# EAGLE design light-ring (EAGLE 7.6.0)
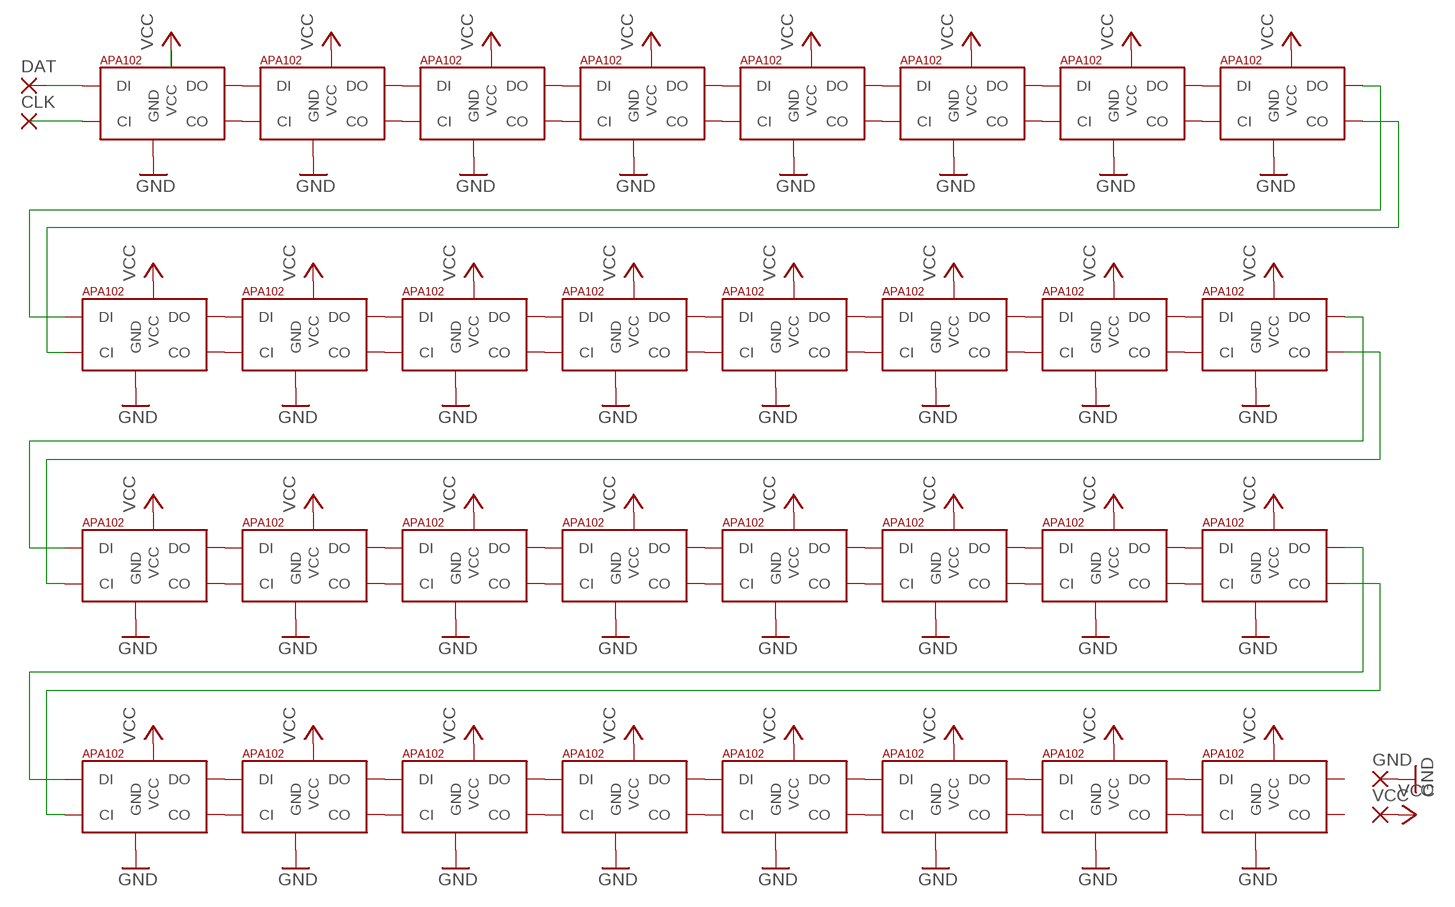
[diagram p0: schematic, sheet 1]

## Parts
CLK  2,15/1,0  [2,15/1,0]
DAT  2,15/1,0  [2,15/1,0]
GND  2,15/1,0  [2,15/1,0]
LED_1  APA1025050  [APA102_5050]
LED_2  APA1025050  [APA102_5050]
LED_3  APA1025050  [APA102_5050]
LED_4  APA1025050  [APA102_5050]
LED_5  APA1025050  [APA102_5050]
LED_6  APA1025050  [APA102_5050]
LED_7  APA1025050  [APA102_5050]
LED_8  APA1025050  [APA102_5050]
LED_9  APA1025050  [APA102_5050]
LED_10  APA1025050  [APA102_5050]
LED_11  APA1025050  [APA102_5050]
LED_12  APA1025050  [APA102_5050]
LED_13  APA1025050  [APA102_5050]
LED_14  APA1025050  [APA102_5050]
LED_15  APA1025050  [APA102_5050]
LED_16  APA1025050  [APA102_5050]
LED_17  APA1025050  [APA102_5050]
LED_18  APA1025050  [APA102_5050]
LED_19  APA1025050  [APA102_5050]
LED_20  APA1025050  [APA102_5050]
LED_21  APA1025050  [APA102_5050]
LED_22  APA1025050  [APA102_5050]
LED_23  APA1025050  [APA102_5050]
LED_24  APA1025050  [APA102_5050]
LED_25  APA1025050  [APA102_5050]
LED_26  APA1025050  [APA102_5050]
LED_27  APA1025050  [APA102_5050]
LED_28  APA1025050  [APA102_5050]
LED_29  APA1025050  [APA102_5050]
LED_30  APA1025050  [APA102_5050]
LED_31  APA1025050  [APA102_5050]
LED_32  APA1025050  [APA102_5050]
VCC  2,15/1,0  [2,15/1,0]

## Nets
CLK_IN: CLK.1(P) LED_1.5(CI)
DAT_IN: DAT.1(P) LED_1.4(DI)
GND: GND.1(P) LED_1.6(GND) LED_2.6(GND) LED_3.6(GND) LED_4.6(GND) LED_5.6(GND) LED_6.6(GND) LED_7.6(GND) LED_8.6(GND) LED_9.6(GND) LED_10.6(GND) LED_11.6(GND) LED_12.6(GND) LED_13.6(GND) LED_14.6(GND) LED_15.6(GND) LED_16.6(GND) LED_17.6(GND) LED_18.6(GND) LED_19.6(GND) LED_20.6(GND) LED_21.6(GND) LED_22.6(GND) LED_23.6(GND) LED_24.6(GND) LED_25.6(GND) LED_26.6(GND) LED_27.6(GND) LED_28.6(GND) LED_29.6(GND) LED_30.6(GND) LED_31.6(GND) LED_32.6(GND)
N$1: LED_1.3(DO) LED_2.4(DI)
N$2: LED_1.2(CO) LED_2.5(CI)
N$3: LED_2.3(DO) LED_3.4(DI)
N$4: LED_2.2(CO) LED_3.5(CI)
N$5: LED_3.3(DO) LED_4.4(DI)
N$6: LED_3.2(CO) LED_4.5(CI)
N$7: LED_4.3(DO) LED_5.4(DI)
N$8: LED_4.2(CO) LED_5.5(CI)
N$9: LED_5.3(DO) LED_6.4(DI)
N$10: LED_5.2(CO) LED_6.5(CI)
N$11: LED_6.3(DO) LED_7.4(DI)
N$12: LED_6.2(CO) LED_7.5(CI)
N$13: LED_7.3(DO) LED_8.4(DI)
N$14: LED_7.2(CO) LED_8.5(CI)
N$15: LED_8.3(DO) LED_9.4(DI)
N$16: LED_8.2(CO) LED_9.5(CI)
N$17: LED_9.2(CO) LED_10.5(CI)
N$18: LED_9.3(DO) LED_10.4(DI)
N$19: LED_10.2(CO) LED_11.5(CI)
N$20: LED_10.3(DO) LED_11.4(DI)
N$21: LED_11.2(CO) LED_12.5(CI)
N$22: LED_11.3(DO) LED_12.4(DI)
N$23: LED_12.2(CO) LED_13.5(CI)
N$24: LED_12.3(DO) LED_13.4(DI)
N$25: LED_13.2(CO) LED_14.5(CI)
N$26: LED_13.3(DO) LED_14.4(DI)
N$27: LED_14.2(CO) LED_15.5(CI)
N$28: LED_14.3(DO) LED_15.4(DI)
N$29: LED_15.2(CO) LED_16.5(CI)
N$30: LED_15.3(DO) LED_16.4(DI)
N$31: LED_17.2(CO) LED_18.5(CI)
N$32: LED_17.3(DO) LED_18.4(DI)
N$33: LED_18.2(CO) LED_19.5(CI)
N$34: LED_18.3(DO) LED_19.4(DI)
N$35: LED_19.2(CO) LED_20.5(CI)
N$36: LED_19.3(DO) LED_20.4(DI)
N$37: LED_20.2(CO) LED_21.5(CI)
N$38: LED_20.3(DO) LED_21.4(DI)
N$39: LED_21.2(CO) LED_22.5(CI)
N$40: LED_21.3(DO) LED_22.4(DI)
N$41: LED_22.2(CO) LED_23.5(CI)
N$42: LED_22.3(DO) LED_23.4(DI)
N$43: LED_23.2(CO) LED_24.5(CI)
N$44: LED_23.3(DO) LED_24.4(DI)
N$45: LED_25.2(CO) LED_26.5(CI)
N$46: LED_25.3(DO) LED_26.4(DI)
N$47: LED_26.2(CO) LED_27.5(CI)
N$48: LED_26.3(DO) LED_27.4(DI)
N$49: LED_27.2(CO) LED_28.5(CI)
N$50: LED_27.3(DO) LED_28.4(DI)
N$51: LED_28.2(CO) LED_29.5(CI)
N$52: LED_28.3(DO) LED_29.4(DI)
N$53: LED_29.2(CO) LED_30.5(CI)
N$54: LED_29.3(DO) LED_30.4(DI)
N$55: LED_30.2(CO) LED_31.5(CI)
N$56: LED_30.3(DO) LED_31.4(DI)
N$57: LED_31.2(CO) LED_32.5(CI)
N$58: LED_31.3(DO) LED_32.4(DI)
N$59: LED_16.3(DO) LED_17.4(DI)
N$60: LED_16.2(CO) LED_17.5(CI)
N$61: LED_24.3(DO) LED_25.4(DI)
N$62: LED_24.2(CO) LED_25.5(CI)
VCC: LED_1.1(VCC) LED_2.1(VCC) LED_3.1(VCC) LED_4.1(VCC) LED_5.1(VCC) LED_6.1(VCC) LED_7.1(VCC) LED_8.1(VCC) LED_9.1(VCC) LED_10.1(VCC) LED_11.1(VCC) LED_12.1(VCC) LED_13.1(VCC) LED_14.1(VCC) LED_15.1(VCC) LED_16.1(VCC) LED_17.1(VCC) LED_18.1(VCC) LED_19.1(VCC) LED_20.1(VCC) LED_21.1(VCC) LED_22.1(VCC) LED_23.1(VCC) LED_24.1(VCC) LED_25.1(VCC) LED_26.1(VCC) LED_27.1(VCC) LED_28.1(VCC) LED_29.1(VCC) LED_30.1(VCC) LED_31.1(VCC) LED_32.1(VCC) VCC.1(P)
Unconnected: LED_32.2(CO) LED_32.3(DO)

## Library data of the parts
CLK DAT GND VCC = wirepad:2,15/1,0: THROUGH-HOLE PAD
LED_1-LED_32 = jos-ph:APA102: APA102C 5050 RGB LED -- Adafruit DotStar Single LED Pixel Product Page: https://www.adafruit.com/products/2343 Datasheet: https://cdn-shop.adafruit.com/product-files/2343/APA102C.pdf

## Board
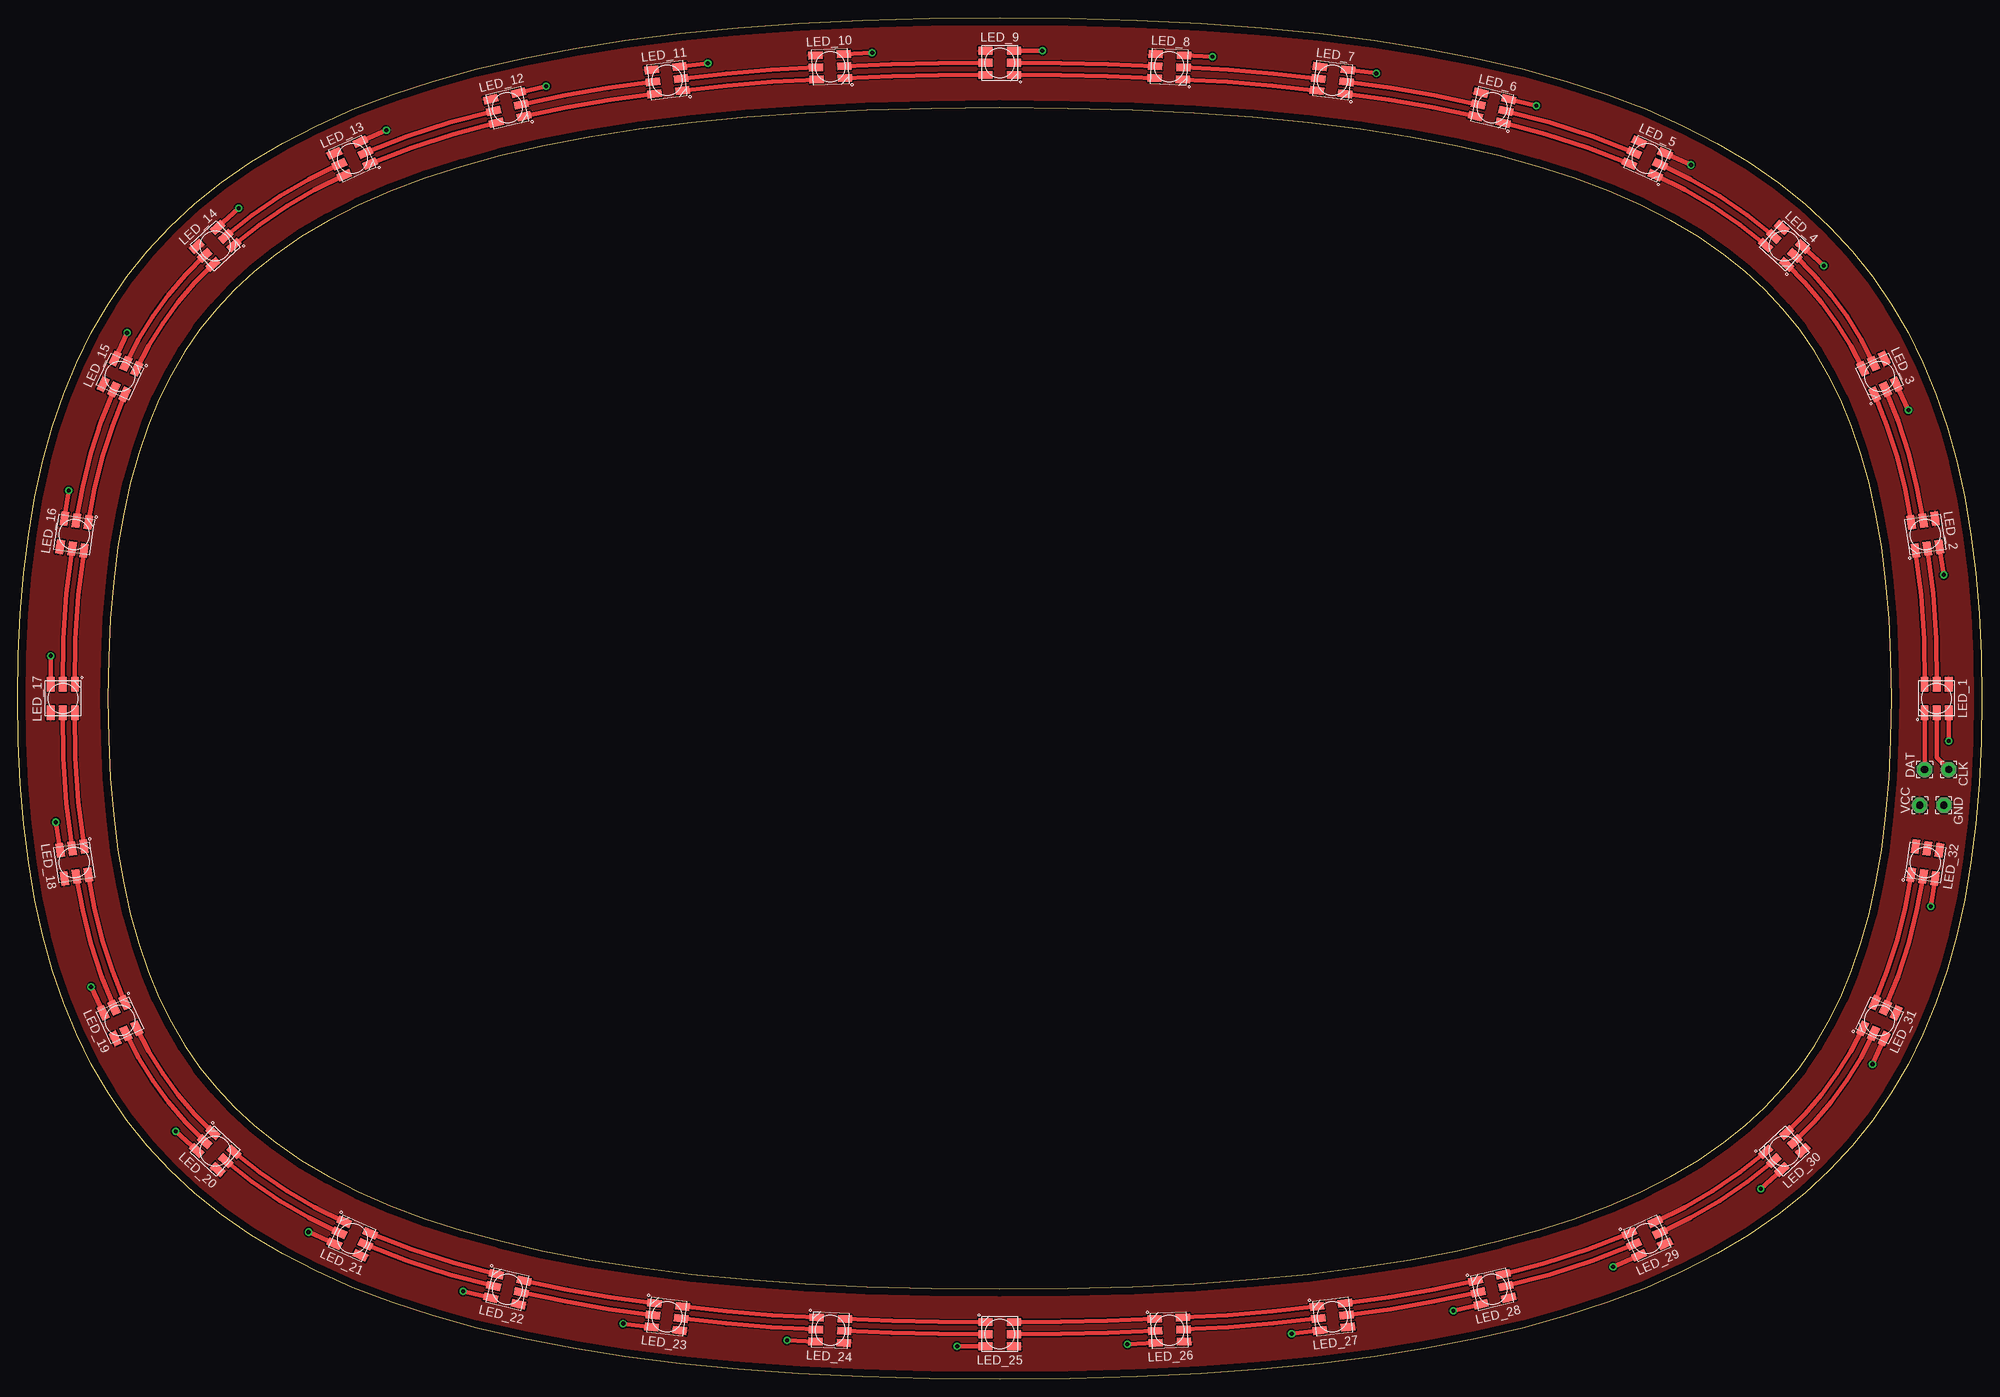
[diagram p1: board, top side]
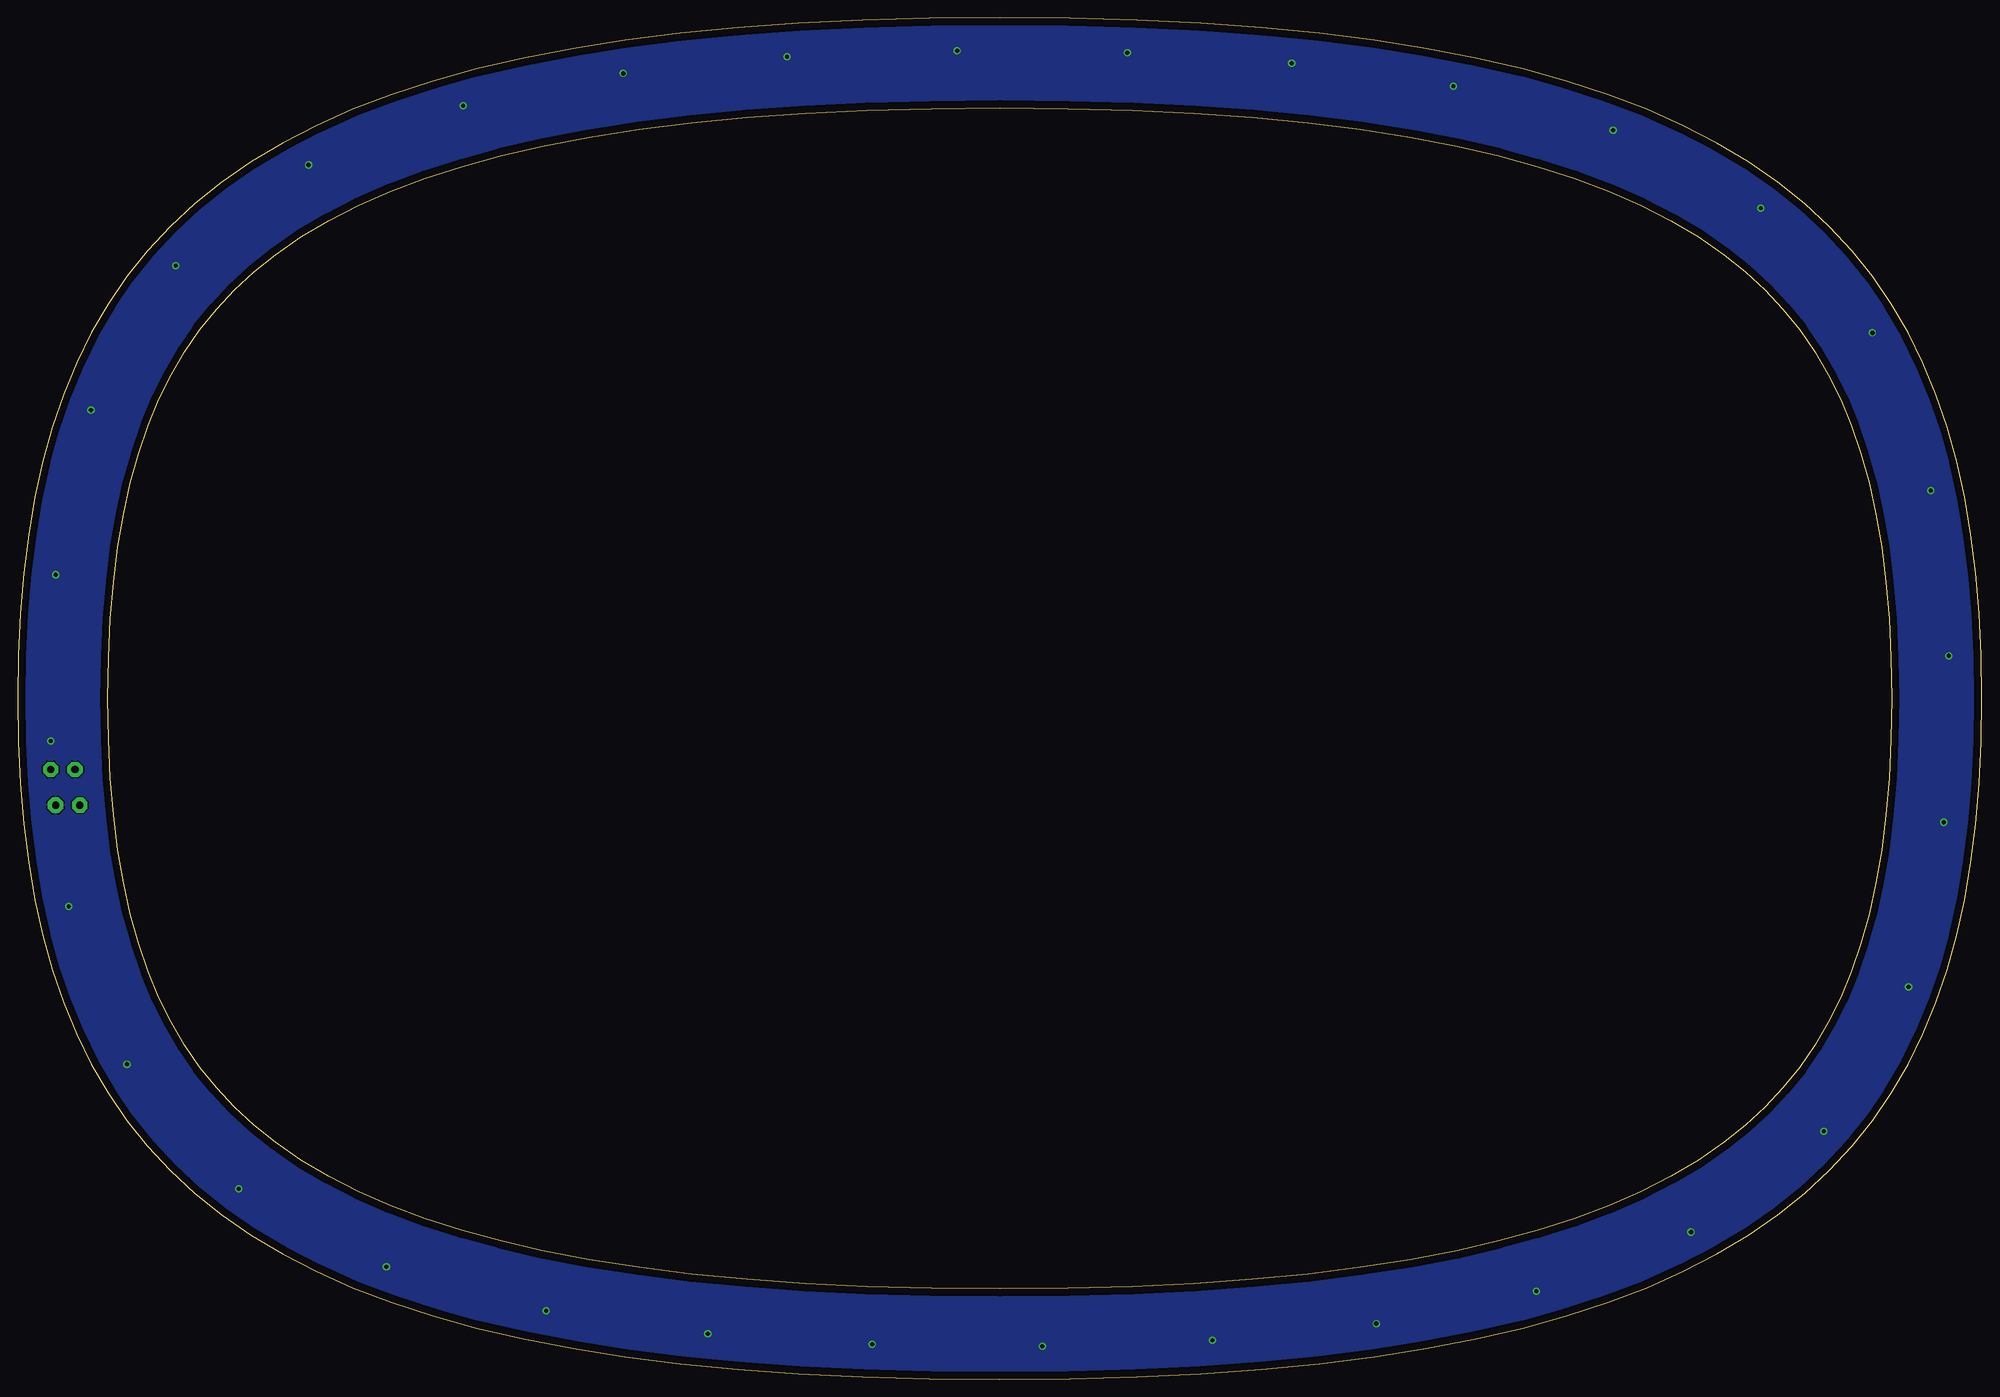
[diagram p2: board, bottom side, seen from below]

Size 276.51 x 191.7 mm. Coordinates in mm from the lower left corner, seen from the top.
Outline: 0,95.85 0.09,101.94 0.37,107.82 0.84,113.49 1.52,118.95 2.42,124.2 3.53,129.25 4.87,134.08 6.46,138.72 8.29,143.15 10.37,147.38 12.72,151.4 15.35,155.23 18.25,158.86 21.45,162.29 24.94,165.53 28.74,168.57 32.85,171.41 37.29,174.07 42.07,176.53 47.18,178.8 52.64,180.89 58.46,182.78 64.65,184.5 71.21,186.02 78.16,187.36 85.5,188.52 93.24,189.5 101.39,190.29 109.96,190.91 118.95,191.35 128.38,191.61 138.25,191.7 148.13,191.61 157.56,191.35 166.55,190.91 175.12,190.29 183.27,189.5 191.01,188.52 198.35,187.36 205.29,186.02 211.86,184.5 218.04,182.78 223.87,180.89 229.33,178.8 234.44,176.53 239.21,174.07 243.65,171.41 247.77,168.57 251.57,165.53 255.06,162.29 258.26,158.86 261.16,155.23 263.78,151.4 266.13,147.38 268.22,143.15 270.05,138.72 271.63,134.08 272.98,129.25 274.09,124.2 274.98,118.95 275.66,113.49 276.14,107.82 276.42,101.94 276.51,95.85 276.42,89.76 276.14,83.88 275.66,78.21 274.98,72.75 274.09,67.5 272.98,62.45 271.63,57.62 270.05,52.98 268.22,48.55 266.13,44.32 263.78,40.3 261.16,36.47 258.26,32.84 255.06,29.41 251.57,26.17 247.77,23.13 243.65,20.29 239.21,17.63 234.44,15.17 229.33,12.9 223.87,10.81 218.04,8.91 211.86,7.21 205.29,5.68 198.35,4.34 191.01,3.18 183.27,2.2 175.12,1.41 166.55,0.79 157.56,0.35 148.13,0.09 138.25,0 128.38,0.09 118.95,0.35 109.96,0.79 101.39,1.41 93.24,2.2 85.5,3.18 78.16,4.34 71.21,5.68 64.65,7.21 58.46,8.91 52.64,10.81 47.18,12.9 42.07,15.17 37.29,17.63 32.85,20.29 28.74,23.13 24.94,26.17 21.45,29.41 18.25,32.84 15.35,36.47 12.72,40.3 10.37,44.32 8.29,48.55 6.46,52.98 4.87,57.62 3.53,62.45 2.42,67.5 1.52,72.75 0.84,78.21 0.37,83.88 0.09,89.76 0,95.85
Outline: 202.66,18.1 208.51,19.46 214.01,20.96 219.18,22.62 224.01,24.43 228.52,26.4 232.71,28.54 236.6,30.85 240.19,33.32 243.19,35.72 245.97,38.29 248.53,41.02 250.88,43.94 253.01,47.03 254.93,50.31 256.65,53.78 258.17,57.45 259.5,61.36 260.65,65.5 261.62,69.89 262.41,74.53 263.02,79.44 263.46,84.63 263.72,90.09 263.81,95.85 263.72,101.61 263.46,107.07 263.02,112.26 262.41,117.17 261.62,121.81 260.65,126.2 259.5,130.34 258.17,134.24 256.65,137.91 254.93,141.39 253.01,144.67 250.88,147.76 248.53,150.67 245.97,153.41 243.19,155.98 240.19,158.38 236.6,160.85 232.71,163.16 228.52,165.29 224.01,167.27 219.18,169.08 214.01,170.74 208.51,172.24 202.66,173.6 196.04,174.87 189.05,175.97 181.66,176.9 173.85,177.66 165.63,178.25 156.96,178.67 147.84,178.92 138.25,179 128.67,178.92 119.55,178.67 110.88,178.25 102.65,177.66 94.85,176.9 87.46,175.97 80.46,174.87 73.85,173.6 68,172.24 62.5,170.74 57.33,169.08 52.5,167.27 47.99,165.29 43.8,163.16 39.91,160.85 36.32,158.38 33.31,155.98 30.54,153.41 27.98,150.67 25.63,147.76 23.5,144.67 21.58,141.39 19.86,137.91 18.34,134.24 17.01,130.34 15.86,126.2 14.89,121.81 14.1,117.17 13.48,112.26 13.05,107.07 12.79,101.61 12.7,95.85 12.79,90.09 13.05,84.63 13.48,79.44 14.1,74.53 14.89,69.89 15.86,65.5 17.01,61.36 18.34,57.45 19.86,53.78 21.58,50.31 23.5,47.03 25.63,43.94 27.98,41.02 30.54,38.29 33.31,35.72 36.32,33.32 39.91,30.85 43.8,28.54 47.99,26.4 52.5,24.43 57.33,22.62 62.5,20.96 68,19.46 73.85,18.1 80.46,16.83 87.46,15.72 94.85,14.8 102.65,14.04 110.88,13.45 119.55,13.03 128.67,12.78 138.25,12.7 147.84,12.78 156.96,13.03 165.63,13.45 173.85,14.04 181.66,14.8 189.05,15.72 196.04,16.83 202.66,18.1
Copper layers (1*16): Top 0.035mm / dielectric 1.5mm / Bottom 0.035mm
Design rules "default": minimum track width 10mil, minimum drill 24mil, track to track 8mil, track to pad 8mil, pad to pad 8mil, via to via 8mil, smd to smd 8mil, copper to edge 40mil, drill to drill 8mil, minimum pad ring 10mil, minimum via ring 8mil, stop-mask expansion 4mil, vias tented up to drill 0mil, thermal gap 10mil
Milling: 128 lines

### Footprints (pad centres in the part's own frame; a part is rotated, then mirrored left to right if it is on the bottom)
2,15/1,0 = drill 1.016 pad 2.159 octagon: 1 0,0
APA102_5050 = smd 2 x 1.1: 1 2,-1.7; 2 2,0; 3 2,1.7; 4 -2,1.7; 5 -2,0; 6 -2,-1.7

### Placement (x,y rotation side)
CLK  271.86,85.85 270 top
DAT  268.46,85.85 90 top
GND  271.17,80.83 270 top
LED_1  270.16,95.85 90 top
LED_2  268.56,118.93 98.8 top
LED_3  262.12,141.19 115 top
LED_4  248.7,159.59 137.6 top
LED_5  229.4,171.88 155.9 top
LED_6  207.57,179.03 166.8 top
LED_7  185.1,182.9 173.1 top
LED_8  162.13,184.8 177.2 top
LED_9  138.25,185.35 180 top
LED_10  114.38,184.8 182.8 top
LED_11  91.41,182.9 186.9 top
LED_12  68.94,179.03 193.2 top
LED_13  47.11,171.88 204.1 top
LED_14  27.81,159.59 222.4 top
LED_15  14.39,141.19 245 top
LED_16  7.95,118.93 261.2 top
LED_17  6.35,95.85 270 top
LED_18  7.95,72.77 278.8 top
LED_19  14.39,50.51 295 top
LED_20  27.81,32.11 317.6 top
LED_21  47.11,19.82 335.9 top
LED_22  68.94,12.67 346.8 top
LED_23  91.41,8.79 353.1 top
LED_24  114.38,6.9 357.2 top
LED_25  138.25,6.35 0 top
LED_26  162.13,6.9 2.8 top
LED_27  185.1,8.79 6.9 top
LED_28  207.57,12.67 13.2 top
LED_29  229.4,19.82 24.1 top
LED_30  248.7,32.11 42.4 top
LED_31  262.12,50.51 65 top
LED_32  268.56,72.77 81.2 top
VCC  267.77,80.83 90 top

### Tracks (layer width: path | path; a pad name or v marks a point on that pad's centre or on a via)
CLK_IN
  Top 0.61: LED_1.5 270.16,87.55 CLK.1
DAT_IN
  Top 0.61: LED_1.4 DAT.1
GND  (via drill 0.6)
  Top 0.61: v120.29,186.79 LED_10.6 | LED_11.6 v97.16,185.31 | LED_9.6 v144.25,187.05 | LED_8.6 v168.2,186.2 | v191.26,183.87 LED_7.6 | LED_6.6 v213.8,179.31 | LED_5.6 v235.57,170.98 | LED_4.6 v254.27,156.8 | LED_12.6 v74.39,182.05 | LED_13.6 v51.89,175.88 | LED_14.6 v31.1,164.89 | v15.39,147.35 LED_15.6 | v7.19,125.12 LED_16.6 | v4.65,101.85 LED_17.6 | v5.35,78.44 LED_18.6 | v10.31,55.23 LED_19.6 | v22.23,34.9 LED_20.6 | v266.19,136.47 LED_3.6 | v40.94,20.72 LED_21.6 | v62.71,12.39 LED_22.6 | v85.25,7.83 LED_23.6 | v108.31,5.5 LED_24.6 | v132.25,4.65 LED_25.6 | v156.22,4.91 LED_26.6 | v179.35,6.39 LED_27.6 | v202.11,9.65 LED_28.6 | v224.62,15.82 LED_29.6 | v245.41,26.81 LED_30.6 | LED_2.6 v271.15,113.26 | LED_31.6 v261.12,44.35 | LED_32.6 v269.32,66.58 | LED_1.6 v271.86,89.85
  Top 0.813: LED_1.6
  pour Bottom: 0,95.85 0.09,101.94 0.37,107.82 0.84,113.49 1.52,118.95 2.42,124.2 3.53,129.24 4.87,134.08 6.46,138.72 8.29,143.15 10.37,147.38 12.72,151.4 15.35,155.23 18.25,158.86 21.45,162.29 24.94,165.53 28.74,168.57 32.85,171.41 37.29,174.07 42.07,176.53 47.18,178.8 52.64,180.89 58.46,182.78 64.65,184.49 71.21,186.02 78.16,187.36 85.5,188.52 93.24,189.5 101.39,190.29 109.96,190.91 118.95,191.35 128.38,191.61 138.25,191.7 148.13,191.61 157.56,191.35 166.55,190.91 175.12,190.29 183.27,189.5 191.01,188.52 198.35,187.36 205.29,186.02 211.86,184.49 218.04,182.78 223.87,180.89 229.33,178.8 234.44,176.53 239.21,174.07 243.65,171.41 247.77,168.57 251.57,165.53 255.06,162.29 258.26,158.86 261.16,155.23 263.78,151.4 266.13,147.38 268.22,143.15 270.05,138.72 271.63,134.08 272.98,129.24 274.09,124.2 274.98,118.95 275.66,113.49 276.14,107.82 276.42,101.94 276.51,95.85 276.42,89.76 276.14,83.88 275.66,78.21 274.98,72.75 274.09,67.5 272.98,62.45 271.63,57.62 270.05,52.98 268.22,48.55 266.13,44.32 263.78,40.3 261.16,36.47 258.26,32.84 255.06,29.41 251.57,26.17 247.77,23.13 243.65,20.29 239.21,17.63 234.44,15.17 229.33,12.9 223.87,10.81 218.04,8.92 211.86,7.2 205.29,5.68 198.35,4.34 191.01,3.18 183.27,2.2 175.12,1.41 166.55,0.79 157.56,0.35 148.13,0.09 138.25,0 128.38,0.09 118.95,0.35 109.96,0.79 101.39,1.41 93.24,2.2 85.5,3.18 78.16,4.34 71.21,5.68 64.65,7.2 58.46,8.92 52.64,10.81 47.18,12.9 42.07,15.17 37.29,17.63 32.85,20.29 28.74,23.13 24.94,26.17 21.45,29.41 18.25,32.84 15.35,36.47 12.72,40.3 10.37,44.32 8.29,48.55 6.46,52.98 4.87,57.62 3.53,62.45 2.42,67.5 1.52,72.75 0.84,78.21 0.37,83.88 0.09,89.76 0,95.85 12.7,95.85 12.79,90.09 13.05,84.63 13.48,79.44 14.1,74.53 14.89,69.89 15.86,65.5 17.01,61.36 18.34,57.46 19.86,53.79 21.58,50.31 23.5,47.03 25.63,43.94 27.98,41.03 30.53,38.29 33.31,35.72 36.32,33.32 39.91,30.85 43.8,28.54 47.99,26.4 52.5,24.43 57.33,22.62 62.5,20.96 68,19.46 73.85,18.1 80.46,16.83 87.46,15.73 94.85,14.8 102.65,14.04 110.88,13.45 119.55,13.03 128.67,12.78 138.25,12.7 147.84,12.78 156.96,13.03 165.63,13.45 173.85,14.04 181.66,14.8 189.05,15.73 196.04,16.83 202.66,18.1 208.51,19.46 214.01,20.96 219.17,22.62 224.01,24.43 228.52,26.4 232.71,28.54 236.6,30.85 240.19,33.32 243.19,35.72 245.97,38.29 248.53,41.03 250.88,43.94 253.01,47.03 254.93,50.31 256.65,53.79 258.16,57.46 259.5,61.36 260.65,65.5 261.62,69.89 262.41,74.53 263.02,79.44 263.46,84.63 263.72,90.09 263.81,95.85 263.72,101.61 263.46,107.07 263.02,112.26 262.41,117.17 261.62,121.81 260.65,126.2 259.5,130.34 258.16,134.24 256.65,137.91 254.93,141.39 253.01,144.67 250.88,147.76 248.53,150.67 245.97,153.41 243.19,155.98 240.19,158.38 236.6,160.85 232.71,163.16 228.52,165.3 224.01,167.27 219.17,169.08 214.01,170.74 208.51,172.24 202.66,173.6 196.04,174.87 189.05,175.97 181.66,176.9 173.85,177.66 165.63,178.25 156.96,178.67 147.84,178.92 138.25,179 128.67,178.92 119.55,178.67 110.88,178.25 102.65,177.66 94.85,176.9 87.46,175.97 80.46,174.87 73.85,173.6 68,172.24 62.5,170.74 57.33,169.08 52.5,167.27 47.99,165.3 43.8,163.16 39.91,160.85 36.32,158.38 33.31,155.98 30.53,153.41 27.98,150.67 25.63,147.76 23.5,144.67 21.58,141.39 19.86,137.91 18.34,134.24 17.01,130.34 15.86,126.2 14.89,121.81 14.1,117.17 13.48,112.26 13.05,107.07 12.79,101.61 12.7,95.85
N$1
  Top 0.61: LED_1.3 arc10 LED_2.4
N$2
  Top 0.61: LED_2.5 arc-10 LED_1.2
N$3
  Top 0.61: LED_3.4 arc-15 LED_2.3
N$4
  Top 0.61: LED_2.2 arc15 LED_3.5
N$5
  Top 0.61: LED_3.3 arc22 LED_4.4
N$6
  Top 0.61: LED_4.5 arc-22 LED_3.2
N$7
  Top 0.61: LED_4.3 arc17 LED_5.4
N$8
  Top 0.61: LED_5.5 arc-17 LED_4.2
N$9
  Top 0.61: LED_6.4 arc-10 LED_5.3
N$10
  Top 0.61: LED_6.5 arc-10 LED_5.2
N$11
  Top 0.61: LED_6.3 arc6 LED_7.4
N$12
  Top 0.61: LED_7.5 arc-6 LED_6.2
N$13
  Top 0.61: LED_8.4 arc-5 LED_7.3
N$14
  Top 0.61: LED_7.2 arc5 LED_8.5
N$15
  Top 0.61: LED_8.3 arc3 LED_9.4
N$16
  Top 0.61: LED_9.5 arc-3 LED_8.2
N$17
  Top 0.61: LED_10.5 arc-3 LED_9.2
N$18
  Top 0.61: LED_9.3 arc3 LED_10.4
N$19
  Top 0.61: LED_11.5 arc-5 LED_10.2
N$20
  Top 0.61: LED_10.3 arc5 LED_11.4
N$21
  Top 0.61: LED_11.2 arc6 LED_12.5
N$22
  Top 0.61: LED_12.4 arc-6 LED_11.3
N$23
  Top 0.61: LED_13.5 arc-10 LED_12.2
N$24
  Top 0.61: LED_12.3 arc10 LED_13.4
N$25
  Top 0.61: LED_13.2 arc17 LED_14.5
N$26
  Top 0.61: LED_14.4 arc-17 LED_13.3
N$27
  Top 0.61: LED_15.5 arc-22 LED_14.2
N$28
  Top 0.61: LED_14.3 arc22 LED_15.4
N$29
  Top 0.61: LED_16.5 arc-15 LED_15.2
N$30
  Top 0.61: LED_15.3 arc15 LED_16.4
N$31
  Top 0.61: LED_17.2 arc10 LED_18.5
N$32
  Top 0.61: LED_18.4 arc-10 LED_17.3
N$33
  Top 0.61: LED_18.2 arc15 LED_19.5
N$34
  Top 0.61: LED_19.4 arc-15 LED_18.3
N$35
  Top 0.61: LED_20.5 arc-22 LED_19.2
N$36
  Top 0.61: LED_19.3 arc22 LED_20.4
N$37
  Top 0.61: LED_21.5 arc-17 LED_20.2
N$38
  Top 0.61: LED_20.3 arc17 LED_21.4
N$39
  Top 0.61: LED_21.2 arc10 LED_22.5
N$40
  Top 0.61: LED_22.4 arc-10 LED_21.3
N$41
  Top 0.61: LED_23.5 arc-6 LED_22.2
N$42
  Top 0.61: LED_22.3 arc6 LED_23.4
N$43
  Top 0.61: LED_24.5 arc-5 LED_23.2
N$44
  Top 0.61: LED_23.3 arc5 LED_24.4
N$45
  Top 0.61: LED_25.2 arc3 LED_26.5
N$46
  Top 0.61: LED_26.4 arc-3 LED_25.3
N$47
  Top 0.61: LED_27.5 arc-5 LED_26.2
N$48
  Top 0.61: LED_26.3 arc5 LED_27.4
N$49
  Top 0.61: LED_28.5 arc-6 LED_27.2
N$50
  Top 0.61: LED_27.3 arc6 LED_28.4
N$51
  Top 0.61: LED_29.5 arc-10 LED_28.2
N$52
  Top 0.61: LED_28.3 arc10 LED_29.4
N$53
  Top 0.61: LED_30.5 arc-17 LED_29.2
N$54
  Top 0.61: LED_29.3 arc17 LED_30.4
N$55
  Top 0.61: LED_30.2 arc22 LED_31.5
N$56
  Top 0.61: LED_31.4 arc-22 LED_30.3
N$57
  Top 0.61: LED_31.2 arc15 LED_32.5
N$58
  Top 0.61: LED_32.4 arc-15 LED_31.3
N$59
  Top 0.61: LED_17.4 arc-10 LED_16.3
N$60
  Top 0.61: LED_16.2 arc10 LED_17.5
N$61
  Top 0.61: LED_24.3 arc3 LED_25.4
N$62
  Top 0.61: LED_25.5 arc-3 LED_24.2
VCC
  pour Top: 0,95.85 0.09,101.94 0.37,107.82 0.84,113.49 1.52,118.95 2.42,124.2 3.53,129.24 4.87,134.08 6.46,138.72 8.29,143.15 10.37,147.38 12.72,151.4 15.35,155.23 18.25,158.86 21.45,162.29 24.94,165.53 28.74,168.57 32.85,171.41 37.29,174.07 42.07,176.53 47.18,178.8 52.64,180.89 58.46,182.78 64.65,184.49 71.21,186.02 78.16,187.36 85.5,188.52 93.24,189.5 101.39,190.29 109.96,190.91 118.95,191.35 128.38,191.61 138.25,191.7 148.13,191.61 157.56,191.35 166.55,190.91 175.12,190.29 183.27,189.5 191.01,188.52 198.35,187.36 205.29,186.02 211.86,184.49 218.04,182.78 223.87,180.89 229.33,178.8 234.44,176.53 239.21,174.07 243.65,171.41 247.77,168.57 251.57,165.53 255.06,162.29 258.26,158.86 261.16,155.23 263.78,151.4 266.13,147.38 268.22,143.15 270.05,138.72 271.63,134.08 272.98,129.24 274.09,124.2 274.98,118.95 275.66,113.49 276.14,107.82 276.42,101.94 276.51,95.85 276.42,89.76 276.14,83.88 275.66,78.21 274.98,72.75 274.09,67.5 272.98,62.45 271.63,57.62 270.05,52.98 268.22,48.55 266.13,44.32 263.78,40.3 261.16,36.47 258.26,32.84 255.06,29.41 251.57,26.17 247.77,23.13 243.65,20.29 239.21,17.63 234.44,15.17 229.33,12.9 223.87,10.81 218.04,8.92 211.86,7.2 205.29,5.68 198.35,4.34 191.01,3.18 183.27,2.2 175.12,1.41 166.55,0.79 157.56,0.35 148.13,0.09 138.25,0 128.38,0.09 118.95,0.35 109.96,0.79 101.39,1.41 93.24,2.2 85.5,3.18 78.16,4.34 71.21,5.68 64.65,7.2 58.46,8.92 52.64,10.81 47.18,12.9 42.07,15.17 37.29,17.63 32.85,20.29 28.74,23.13 24.94,26.17 21.45,29.41 18.25,32.84 15.35,36.47 12.72,40.3 10.37,44.32 8.29,48.55 6.46,52.98 4.87,57.62 3.53,62.45 2.42,67.5 1.52,72.75 0.84,78.21 0.37,83.88 0.09,89.76 0,95.85 12.7,95.85 12.79,90.09 13.05,84.63 13.48,79.44 14.1,74.53 14.89,69.89 15.86,65.5 17.01,61.36 18.34,57.46 19.86,53.79 21.58,50.31 23.5,47.03 25.63,43.94 27.98,41.03 30.53,38.29 33.31,35.72 36.32,33.32 39.91,30.85 43.8,28.54 47.99,26.4 52.5,24.43 57.33,22.62 62.5,20.96 68,19.46 73.85,18.1 80.46,16.83 87.46,15.73 94.85,14.8 102.65,14.04 110.88,13.45 119.55,13.03 128.67,12.78 138.25,12.7 147.84,12.78 156.96,13.03 165.63,13.45 173.85,14.04 181.66,14.8 189.05,15.73 196.04,16.83 202.66,18.1 208.51,19.46 214.01,20.96 219.17,22.62 224.01,24.43 228.52,26.4 232.71,28.54 236.6,30.85 240.19,33.32 243.19,35.72 245.97,38.29 248.53,41.03 250.88,43.94 253.01,47.03 254.93,50.31 256.65,53.79 258.16,57.46 259.5,61.36 260.65,65.5 261.62,69.89 262.41,74.53 263.02,79.44 263.46,84.63 263.72,90.09 263.81,95.85 263.72,101.61 263.46,107.07 263.02,112.26 262.41,117.17 261.62,121.81 260.65,126.2 259.5,130.34 258.16,134.24 256.65,137.91 254.93,141.39 253.01,144.67 250.88,147.76 248.53,150.67 245.97,153.41 243.19,155.98 240.19,158.38 236.6,160.85 232.71,163.16 228.52,165.3 224.01,167.27 219.17,169.08 214.01,170.74 208.51,172.24 202.66,173.6 196.04,174.87 189.05,175.97 181.66,176.9 173.85,177.66 165.63,178.25 156.96,178.67 147.84,178.92 138.25,179 128.67,178.92 119.55,178.67 110.88,178.25 102.65,177.66 94.85,176.9 87.46,175.97 80.46,174.87 73.85,173.6 68,172.24 62.5,170.74 57.33,169.08 52.5,167.27 47.99,165.3 43.8,163.16 39.91,160.85 36.32,158.38 33.31,155.98 30.53,153.41 27.98,150.67 25.63,147.76 23.5,144.67 21.58,141.39 19.86,137.91 18.34,134.24 17.01,130.34 15.86,126.2 14.89,121.81 14.1,117.17 13.48,112.26 13.05,107.07 12.79,101.61 12.7,95.85